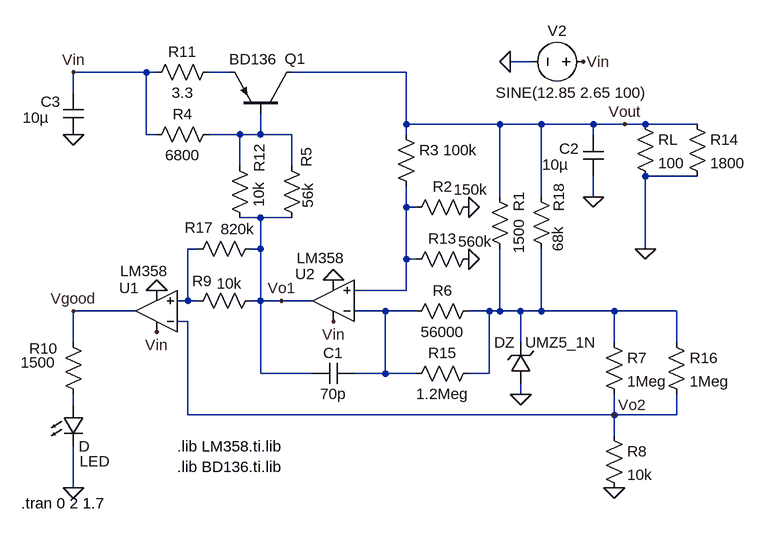
[diagram p0: schematic lab2t standart.asc]
lab2t standart.asc, the LTspice schematic file:
Version 4
SHEET 1 1080 680
WIRE 640 -48 608 -48
WIRE 48 -32 -64 -32
WIRE 64 -32 48 -32
WIRE 176 -32 144 -32
WIRE 448 -32 272 -32
WIRE -64 0 -64 -32
WIRE 448 48 448 -32
WIRE 592 48 448 48
WIRE 656 48 592 48
WIRE 736 48 656 48
WIRE 784 48 736 48
WIRE 816 48 784 48
WIRE 896 48 816 48
WIRE 48 64 48 -32
WIRE 64 64 48 64
WIRE 192 64 144 64
WIRE 224 64 224 32
WIRE 224 64 192 64
WIRE 272 64 224 64
WIRE 448 64 448 48
WIRE 736 64 736 48
WIRE 192 112 192 64
WIRE 272 112 272 64
WIRE 896 128 816 128
WIRE 592 160 592 48
WIRE 656 160 656 48
WIRE 736 160 736 128
WIRE 448 176 448 144
WIRE 464 176 448 176
WIRE 224 192 192 192
WIRE 272 192 224 192
WIRE 128 240 112 240
WIRE 224 240 224 192
WIRE 224 240 208 240
WIRE 816 240 816 128
WIRE 448 256 448 176
WIRE 464 256 448 256
WIRE 448 304 448 256
WIRE 448 304 368 304
WIRE 112 320 112 240
WIRE 112 320 96 320
WIRE 128 320 112 320
WIRE 224 320 224 240
WIRE 224 320 208 320
WIRE 256 320 224 320
WIRE 304 320 256 320
WIRE 32 336 -64 336
WIRE 416 336 368 336
WIRE 464 336 416 336
WIRE 576 336 544 336
WIRE 592 336 592 240
WIRE 592 336 576 336
WIRE 624 336 592 336
WIRE 656 336 656 240
WIRE 656 336 624 336
WIRE 768 336 656 336
WIRE 864 336 768 336
WIRE 112 352 96 352
WIRE -64 384 -64 336
WIRE 624 384 624 336
WIRE 768 384 768 336
WIRE 864 384 864 336
WIRE 224 432 224 320
WIRE 304 432 224 432
WIRE 416 432 416 336
WIRE 416 432 368 432
WIRE 464 432 416 432
WIRE 576 432 576 336
WIRE 576 432 544 432
WIRE 624 464 624 448
WIRE -64 480 -64 464
WIRE 112 496 112 352
WIRE 768 496 768 464
WIRE 768 496 112 496
WIRE 864 496 864 464
WIRE 864 496 768 496
WIRE 768 528 768 496
WIRE -64 608 -64 544
FLAG 624 464 0
FLAG 736 160 0
FLAG -64 64 0
FLAG -64 608 0
FLAG 768 608 0
FLAG 784 48 Vout
FLAG -64 336 Vgood
FLAG 768 496 Vo2
FLAG 256 320 Vo1
FLAG 336 352 Vin
FLAG 64 368 Vin
FLAG 64 304 0
FLAG 336 288 0
FLAG -64 -32 Vin
FLAG 720 -48 Vin
FLAG 816 240 0
FLAG 544 256 0
FLAG 544 176 0
FLAG 608 -48 0
SYMBOL cap -80 0 R0
WINDOW 0 -34 13 Left 2
WINDOW 3 -62 38 Left 2
SYMATTR InstName C3
SYMATTR Value 10µ
SYMBOL res 160 -48 R90
WINDOW 0 0 56 VBottom 2
WINDOW 3 32 56 VTop 2
SYMATTR InstName R11
SYMATTR Value 3.3
SYMBOL res 160 48 R90
WINDOW 0 0 56 VBottom 2
WINDOW 3 32 56 VTop 2
SYMATTR InstName R4
SYMATTR Value 6800
SYMBOL pnp 272 32 M270
WINDOW 0 85 11 VLeft 2
WINDOW 3 84 96 VLeft 2
SYMATTR InstName Q1
SYMATTR Value BD136
SYMBOL res 256 96 R0
WINDOW 3 41 82 VLeft 2
WINDOW 0 38 19 VLeft 2
SYMATTR Value 56k
SYMATTR InstName R5
SYMBOL OpAmps\\opamp2 64 400 R180
WINDOW 0 27 100 Left 2
WINDOW 3 -18 126 Left 2
SYMATTR InstName U1
SYMATTR Value LM358
SYMBOL cap 368 416 R90
WINDOW 0 0 32 VBottom 2
WINDOW 3 32 32 VTop 2
SYMATTR InstName C1
SYMATTR Value 70p
SYMBOL OpAmps\\opamp2 336 384 R180
WINDOW 0 28 105 Left 2
WINDOW 3 -18 130 Left 2
SYMATTR InstName U2
SYMATTR Value LM358
SYMBOL res 560 320 R90
WINDOW 0 0 56 VBottom 2
WINDOW 3 32 56 VTop 2
SYMATTR InstName R6
SYMATTR Value 56000
SYMBOL zener 640 448 R180
WINDOW 0 24 64 Left 2
WINDOW 3 -101 64 Left 2
SYMATTR InstName DZ
SYMATTR Value UMZ5_1N
SYMBOL res 432 48 R0
WINDOW 3 73 40 Left 2
SYMATTR Value 100k
SYMATTR InstName R3
SYMBOL res 576 144 R0
WINDOW 0 45 39 VLeft 2
WINDOW 3 45 49 VRight 2
SYMATTR InstName R1
SYMATTR Value 1500
SYMBOL res 800 32 R0
SYMATTR InstName RL
SYMATTR Value 100
SYMBOL cap 720 64 R0
WINDOW 0 -37 22 Left 2
WINDOW 3 -63 46 Left 2
SYMATTR InstName C2
SYMATTR Value 10µ
SYMBOL res 752 368 R0
SYMATTR InstName R7
SYMATTR Value 1Meg
SYMBOL res 752 512 R0
SYMATTR InstName R8
SYMATTR Value 10k
SYMBOL res -80 368 R0
WINDOW 0 -52 25 Left 2
WINDOW 3 -65 47 Left 2
SYMATTR InstName R10
SYMATTR Value 1500
SYMBOL LED -80 480 R0
WINDOW 0 26 87 Left 2
SYMATTR InstName LED
SYMBOL res 224 304 R90
WINDOW 0 1 90 VBottom 2
WINDOW 3 -26 48 VTop 2
SYMATTR InstName R9
SYMATTR Value 10k
SYMBOL voltage 736 -48 R90
WINDOW 0 -32 56 VBottom 2
WINDOW 3 32 33 VTop 2
WINDOW 123 0 0 Left 0
WINDOW 39 0 0 Left 0
SYMATTR InstName V2
SYMATTR Value SINE(12.85 2.65 100)
SYMBOL res 176 96 R0
WINDOW 0 46 26 VLeft 2
WINDOW 3 45 41 VRight 2
SYMATTR InstName R12
SYMATTR Value 10k
SYMBOL res 560 160 R90
WINDOW 0 0 56 VBottom 2
WINDOW 3 -27 13 VTop 2
SYMATTR InstName R2
SYMATTR Value 150k
SYMBOL res 560 240 R90
WINDOW 0 0 56 VBottom 2
WINDOW 3 -27 6 VTop 2
SYMATTR InstName R13
SYMATTR Value 560k
SYMBOL res 880 32 R0
SYMATTR InstName R14
SYMATTR Value 1800
SYMBOL res 560 416 R90
WINDOW 0 0 56 VBottom 2
WINDOW 3 32 56 VTop 2
SYMATTR InstName R15
SYMATTR Value 1.2Meg
SYMBOL res 848 368 R0
SYMATTR InstName R16
SYMATTR Value 1Meg
SYMBOL res 224 224 R90
WINDOW 0 -1 95 VBottom 2
WINDOW 3 -30 35 VTop 2
SYMATTR InstName R17
SYMATTR Value 820k
SYMBOL res 640 144 R0
WINDOW 0 43 39 VLeft 2
WINDOW 3 41 101 VLeft 2
SYMATTR InstName R18
SYMATTR Value 68k
TEXT 96 544 Left 2 !.lib LM358.ti.lib
TEXT 96 576 Left 2 !.lib BD136.ti.lib
TEXT -144 632 Left 2 !.tran 0 2 1.7

The netlist it stands for:
* lab2t standart.asc
C3 Vin 0 10µ
R11 N001 Vin 3.3
R4 N002 Vin 6800
Q1 Vout N002 N001 0 BD136
R5 N002 Vo1 56k
XU1 N004 Vo2 Vin 0 Vgood LM358  ; pins In+ In- V+ V- OUT
C1 N005 Vo1 70p
XU2 N003 N005 Vin 0 Vo1 LM358  ; pins In+ In- V+ V- OUT
R6 N006 N005 56000
DZ 0 N006 UMZ5_1N
R3 Vout N003 100k
R1 Vout N006 1500
RL Vout 0 100
C2 Vout 0 10µ
R7 N006 Vo2 1Meg
R8 Vo2 0 10k
R10 Vgood N007 1500
D§LED N007 0 D
R9 Vo1 N004 10k
V2 Vin 0 SINE(12.85 2.65 100)
R12 N002 Vo1 10k
R2 0 N003 150k
R13 0 N003 560k
R14 Vout 0 1800
R15 N006 N005 1.2Meg
R16 N006 Vo2 1Meg
R17 Vo1 N004 820k
R18 Vout N006 68k
.model D D
.lib standard.dio
.model NPN NPN
.model PNP PNP
.lib standard.bjt
.lib LM358.ti.lib
.lib BD136.ti.lib
.tran 0 2 1.7
.backanno
.end